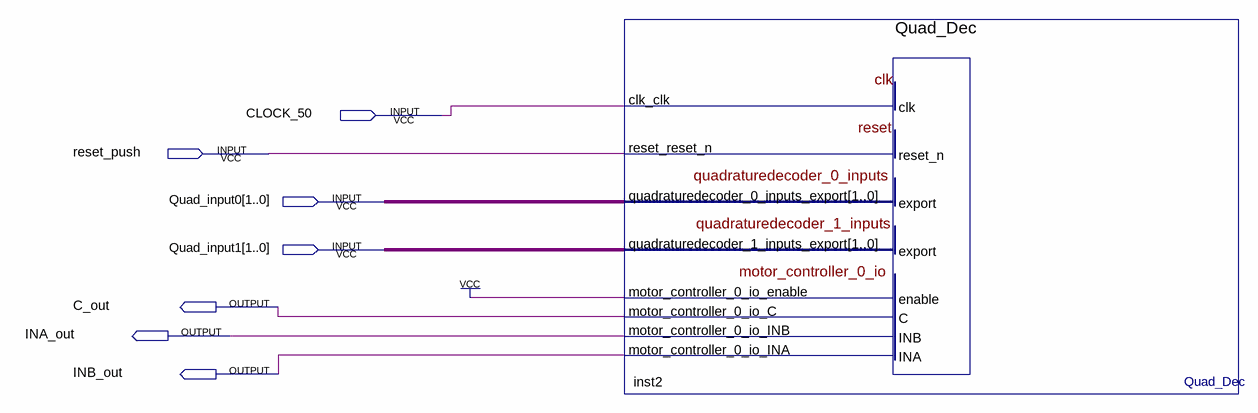
[diagram p0: schematic sheet]
// Quartus schematic esl_as4.bdf as structural Verilog: 1 symbols, 7 pins
module esl_as4 (
  input  CLOCK_50,
  input  reset_push,
  input  [1:0] Quad_input0,
  input  [1:0] Quad_input1,
  output C_out,
  output INA_out,
  output INB_out
);

  Quad_Dec inst2 (
    .clk_clk(CLOCK_50), .reset_reset_n(reset_push), .quadraturedecoder_0_inputs_export(Quad_input0),
    .quadraturedecoder_1_inputs_export(Quad_input1), .motor_controller_0_io_enable(1'b1),
    .motor_controller_0_io_C(C_out), .motor_controller_0_io_INB(INA_out), .motor_controller_0_io_INA(INB_out));
endmodule
